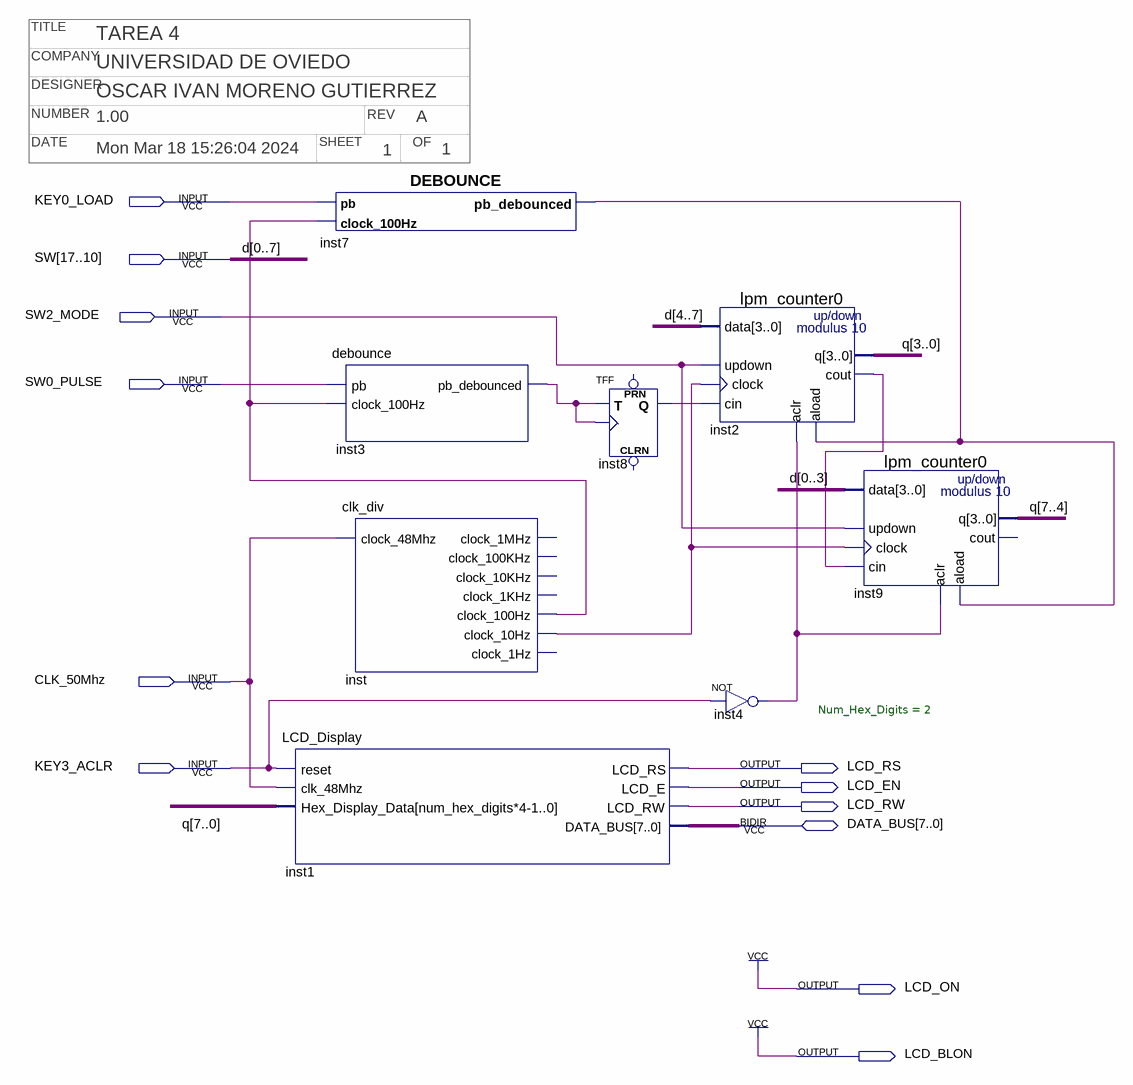
[diagram p0: schematic sheet]
// Quartus schematic tutor3.bdf as structural Verilog: 8 symbols, 12 pins
// Title block: COMPANY: UNIVERSIDAD DE OVIEDO; DATE: Mon Mar 18 15:26:04 2024; DESIGNER: OSCAR IVAN MORENO GUTIERREZ; NUMBER: 1.00; OF: 1; REV: A; SHEET: 1; TITLE: TAREA 4
module tutor3 (
  input  KEY0_LOAD,
  input  [17:10] SW,
  input  SW2_MODE,
  input  SW0_PULSE,
  input  CLK_50Mhz,
  input  KEY3_ACLR,
  inout  [7:0] DATA_BUS,
  output LCD_RS,
  output LCD_EN,
  output LCD_RW,
  output LCD_ON,
  output LCD_BLON
);

  wire inst2_cout, inst3_pb_debounced, inst4_out, inst7_pb_debounced, inst8_q, inst_clock_10hz,
       inst_clock_100hz;
  wire [7:0] q;

  DEBOUNCE inst7 (.pb(KEY0_LOAD), .clock_100Hz(inst_clock_100hz), .pb_debounced(inst7_pb_debounced));
  debounce inst3 (.pb(SW0_PULSE), .clock_100Hz(inst_clock_100hz), .pb_debounced(inst3_pb_debounced));
  clk_div inst (
    .clock_48Mhz(CLK_50Mhz), .clock_100Hz(inst_clock_100hz), .clock_10Hz(inst_clock_10hz));  // open: clock_1MHz, clock_100KHz, clock_10KHz, clock_1KHz, clock_1Hz
  LCD_Display #(.Num_Hex_Digits(2)) inst1 (
    .reset(KEY3_ACLR), .clk_48Mhz(CLK_50Mhz), .Hex_Display_Data(q), .LCD_RS(LCD_RS), .LCD_E(LCD_EN),
    .LCD_RW(LCD_RW), .DATA_BUS(DATA_BUS));
  TFF inst8 (.T(inst3_pb_debounced), .CLK(inst3_pb_debounced), .Q(inst8_q));  // open: PRN, CLRN
  lpm_counter0 inst2 (
    .data(SW[13:10]), .updown(SW2_MODE), .clock(inst_clock_10hz), .cin(inst8_q), .aclr(inst4_out),
    .aload(inst7_pb_debounced), .q(q[3:0]), .cout(inst2_cout));
  not inst4 (inst4_out, KEY3_ACLR);
  lpm_counter0 inst9 (
    .data(SW[17:14]), .updown(SW2_MODE), .clock(inst_clock_10hz), .cin(inst2_cout), .aclr(inst4_out),
    .aload(inst7_pb_debounced), .q(q[7:4]));  // open: cout

  assign LCD_BLON = 1'b1;
  assign LCD_ON = 1'b1;

  // Other names for the same wires on the sheet: d[7:0] = {SW[10], SW[11], SW[12], SW[13], SW[14], SW[15], SW[16], SW[17]}
endmodule
